# EasyEDA Pro project ProPrj_G4SC5.5开源版.epro, board PCB_G4SC5.5
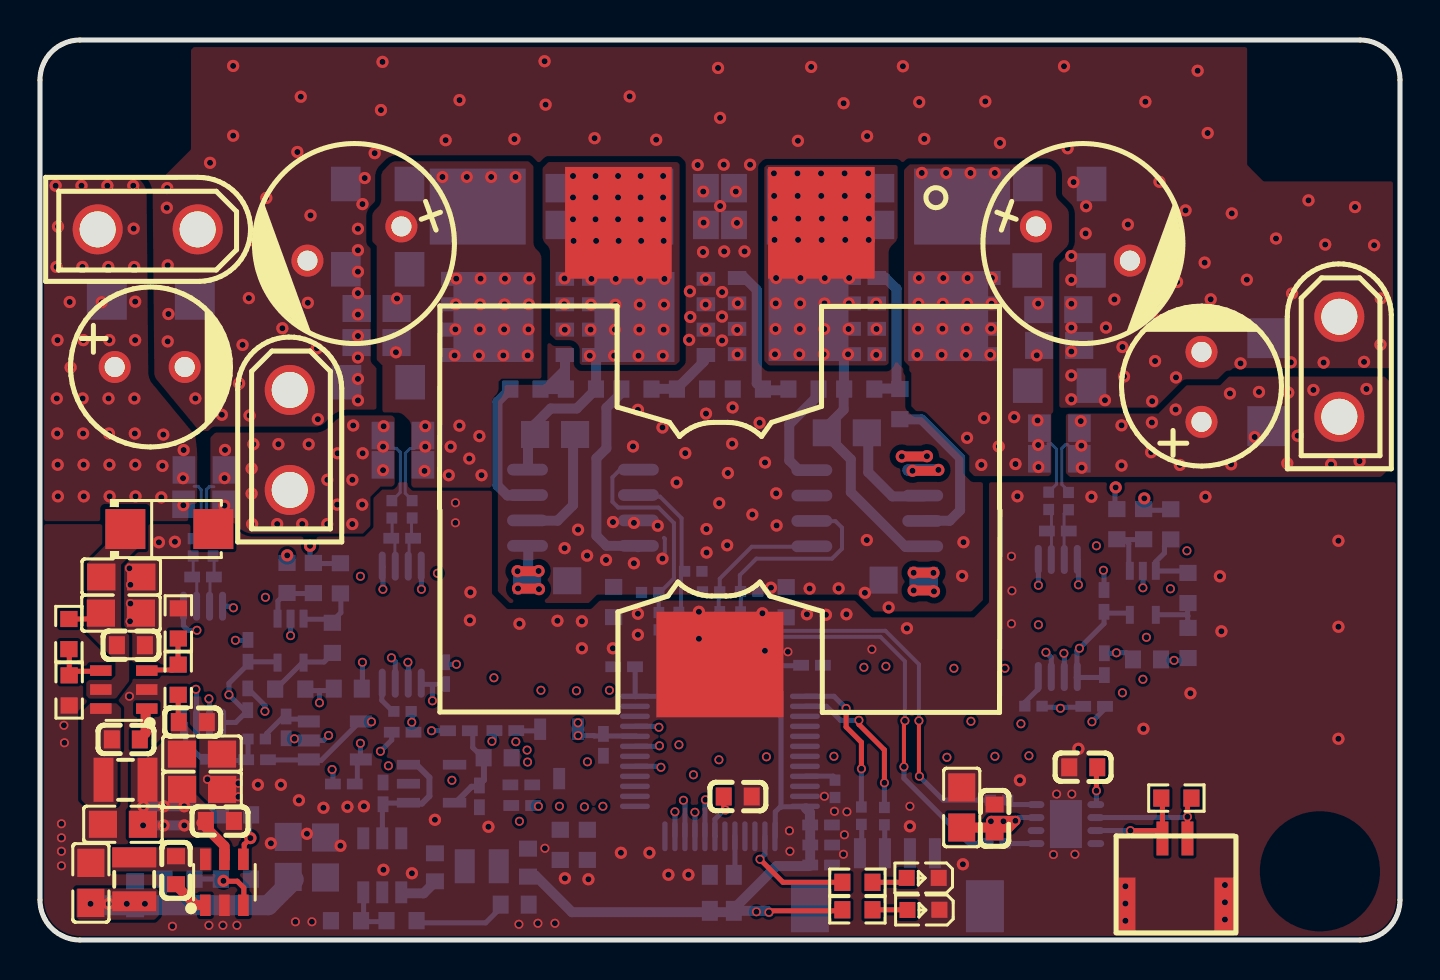
[diagram p4: board, top side]
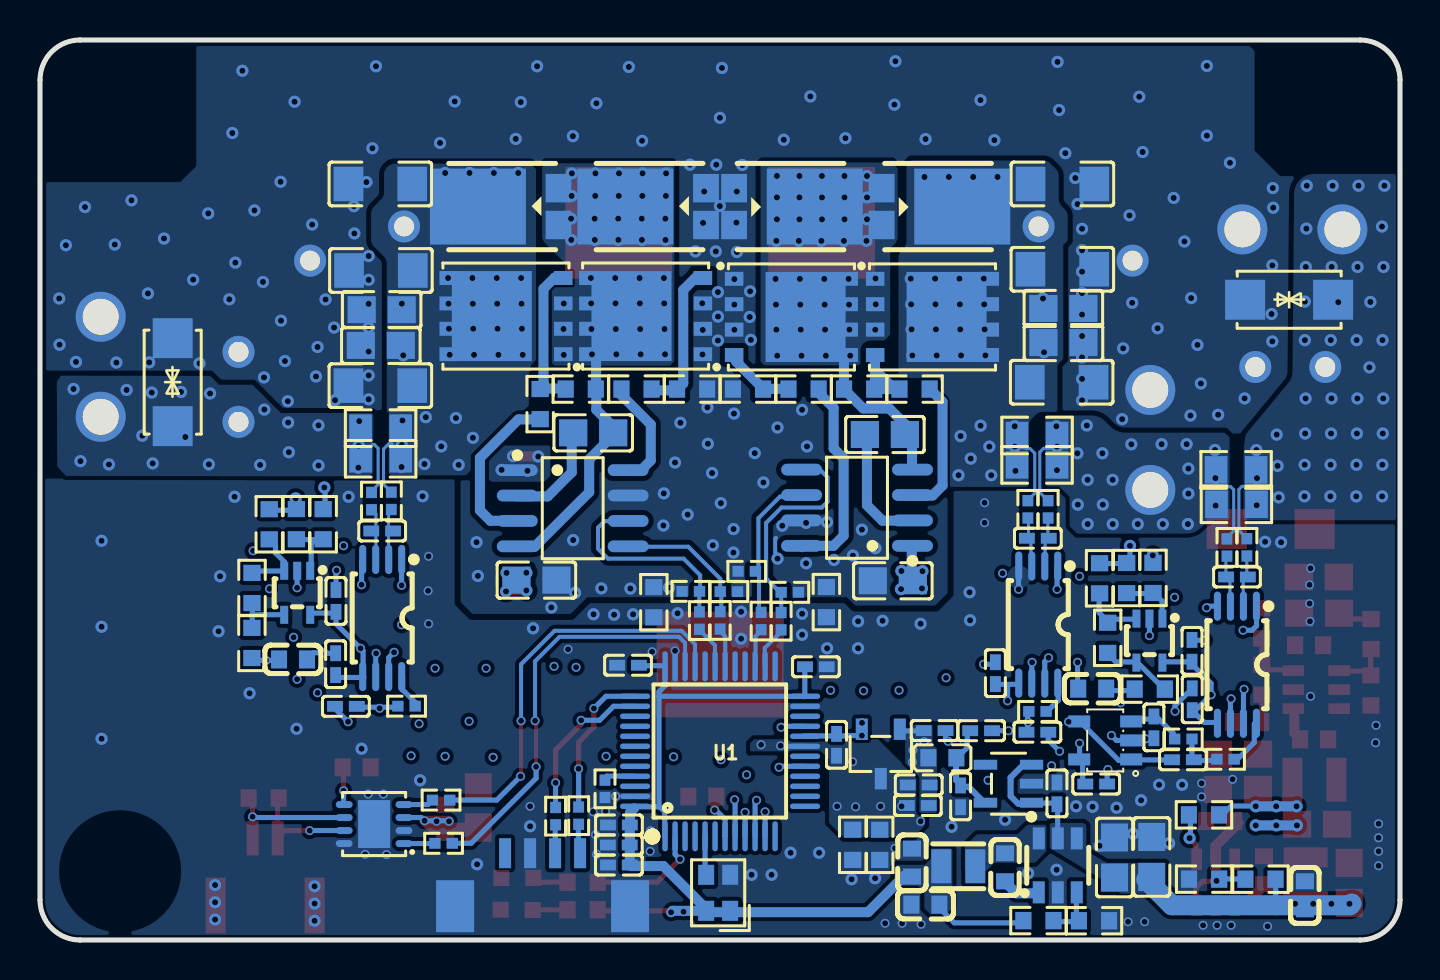
[diagram p5: board, bottom side, seen from below]

Outline 68 x 45 mm; copper layers: Top Layer, Inner1, Inner2, Bottom Layer. Coordinates in mm from the lower left corner of the outline.
Outline path: 0,43 0,2 arc(0.59,0.59) 2,0 66,0 arc(67.41,0.59) 68,2 68,43 arc(67.41,44.41) 66,45 2,45 arc(0.59,44.41) 0,43
Stack: Top Layer 0.035mm / Dielectric1 0.48mm PP er 4.5 / Inner1 0.035mm / Dielectric2 0.48mm FR4 er 4.5 / Inner2 0.035mm / Dielectric3 0.48mm PP er 4.5 / Bottom Layer 0.035mm

## Design rules (mm)
template: 自定义配置
spacing copperThickness1oz (default): track to track 0.102, other pairs 0.11 to 0.3
spacing copperThickness2oz: track to track 0.203, other pairs 0.152 to 0.3
spacing copperThicknessInner0.5oz: track to track 0.089, other pairs 0.152 to 0.3
track width copperThickness1oz (default): min 0.102, default 0.254, max 2.54
track width copperThickness0.5oz: min 0.089, default 0.254, max 2.54
track width copperThickness2oz: min 0.203, default 0.254, max 2.54
differential pair differentialPair (default): width min 0.127, default 0.254, max 2.54; gap min 0.152, default 0.152
via viaSize (default): diameter min 0.3, default 0.61, max 10; hole min 0.2, default 0.305, max 6.3
net VBAT+ uses copperRegion1
pour e76 uses copperRegion1
pour e292 uses copperRegion1
pour e291 uses copperRegion1
pour e290 uses copperRegion1
pour e354 uses copperRegion1
pour e411 uses copperRegion1
pour e534 uses copperRegion1
pour e833 uses copperRegion1
pour e858 uses copperRegion1
pour e913 uses copperRegion1
pour e923 uses copperRegion1
pour e976 uses copperRegion1
pour e1065 uses copperRegion1
pour e1098 uses copperRegion1
pour e1099 uses copperRegion1
pour e1100 uses copperRegion1
pour e1128 uses copperRegion2
pour e2410 uses copperRegion2
pour e2456 uses copperRegion2
pour e2854 uses copperRegion2
pour e2925 uses copperRegion2
pour e2249 uses copperRegion2
pour e11 uses copperRegion1
pour e466 uses copperRegion2
pour e112 uses copperRegion2
pour e215 uses copperRegion1
pour e287 uses copperRegion1
pour e300 uses copperRegion1
pour e317 uses copperRegion2
pour e421 uses copperRegion2
pour e434 uses copperRegion1
pour e942 uses copperRegion2
pour e383 uses copperRegion2
pour e1427 uses copperRegion1
pour e1619 uses copperRegion1
pour e1968 uses copperRegion2
pour e1898 uses copperRegion2
pour e428 uses copperRegion2
pour e3041 uses copperRegion2
pour e3047 uses copperRegion1

## Placement (name value [footprint] x y rotation side)
C1  100nF  [C0402]  20.95 10.46 0 bottom
C2  100nF  [C0402]  23.27 10.47 0 bottom
C3  4.7uF  [C0402]  24.11 6.73 180 bottom
C4  100nF  [C0402]  39.05 5.75 180 bottom
C5  100nF  [C0402]  39.06 4.75 180 bottom
C6  100nF  [C0402]  38.6 13.74 180 bottom
C7  100nF  [C0402]  29.21 13.66 0 bottom
C8  4.7uF  [C0402]  39.06 3.75 180 bottom
C10  10nF  [C0603]  55.35 14.03 180 bottom
C12  10nF  [C0603]  15.39 12.57 0 bottom
C13  100nF  [C0603]  34.89 7.18 180 top
C14  100nF  [C0603]  47.73 6.07 270 top
C15  100nF  [C0603]  52.16 8.64 0 top
C17  100nF  [C0603]  4.29 10.03 180 top
C18  100nF  [C0603]  7.64 10.89 0 top
C19  10uF  [C0805]  8.1 9.3 0 top
C20  10uF  [C0805]  8.1 7.53 0 top
C21  100nF  [C0603]  4.54 14.74 180 top
C22  4.7uF  [C0805]  4.05 16.34 180 top
C23  4.7uF  [C0805]  4.06 18.15 180 top
C24  100nF  [C0603]  6.8 3.49 90 top
C25  100nF  [C0603]  4.76 2.24 90 bottom
C26  10uF  [C0805]  2.54 2.85 90 top
C27  100nF  [C0603]  9 5.95 180 top
C28  4.7uF  [C0805]  4.15 5.79 0 top
C29  100nF  [C0402]  53.22 13.79 90 bottom
C30  10nF  [C0402]  52.71 11.68 180 bottom
C31  4.7uF  [C0402]  17.15 7.33 90 bottom
C32  4.7uF  [C0402]  21.97 7.18 90 bottom
C33  100nF  [C0402]  8.15 18.15 180 bottom
C34  100nF  [C0402]  20.23 13.34 90 bottom
C36  100nF  [C0402]  18.11 20.09 180 bottom
C37  100nF  [C0402]  10.39 12.04 90 bottom
C38  100nF  [C0402]  50.89 20.45 180 bottom
C39  100nF  [C0402]  24.07 7.75 180 bottom
C40  100nF  [C0402]  28.17 9.76 90 bottom
C41  10nF  [C0402]  18.13 10.39 0 bottom
C44  2.2nF  [C0805]  16.83 31.58 0 bottom
C45  2.2nF  [C0805]  16.83 29.87 0 bottom
C46  470uF  [CAP-TH_BD10.0-P5.00-D0.6-FD]  52.15 34.82 340 top
C47  470uF  [CAP-TH_BD10.0-P5.00-D0.6-FD]  15.72 34.82 200 top
C49  2.2nF  [C0805]  50.92 31.52 180 bottom
C50  4.7uF  [C1206]  50.98 27.72 180 bottom
C51  2.2nF  [C0805]  50.96 29.73 180 bottom
C59  100uF  [footprint_08d0]  5.49 28.65 0 top
C111  1uF  [C0805]  25.76 25.27 0 bottom
C112  1uF  [C0805]  40.34 25.36 0 bottom
C113  10uF  [C0805]  43.18 17.99 180 bottom
C114  10uF  [C0805]  25.36 17.96 0 bottom
C115  100uF  [footprint_08d0]  58.08 27.66 90 top
C116  100nF  [C0402]  10.4 14.46 90 bottom
C117  100nF  [C0402]  53.2 16.95 90 bottom
C118  51pF  [C0402]  12.3 10.63 90 bottom
C119  100pF  [C0402]  10.85 9.01 180 bottom
C120  100nF  [C0402]  15.19 7.8 0 bottom
C121  4.7uF  [C1206]  50.95 33.48 180 bottom
C122  4.7uF  [C1206]  16.92 27.89 0 bottom
C123  4.7uF  [C1206]  16.88 37.8 0 bottom
C124  100nF  [C0603]  19.75 3.63 90 bottom
C125  100nF  [C0603]  23.73 1.77 0 bottom
C126  22uF  [C0805]  14.27 4.12 270 bottom
C127  22uF  [C0805]  12.41 4.15 270 bottom
C128  22uF  [C0603]  24.4 3.87 90 bottom
C130  10uF  [C0805]  46.09 6.62 270 top
C131  4.7uF  [C1206]  50.98 37.8 180 bottom
C132  4.7uF  [C1206]  16.88 33.54 0 bottom
CAN1  GH1.25-2P-立式贴片  [footprint_47b1]  56.75 3.4 180 top
CN1  XT30UPB-M  [footprint_f264]  64.97 28.66 270 top
CN4  XT30UPB-M  [footprint_f264]  5.38 35.53 180 top
CN5  XT30UPB-M  [footprint_5e48]  12.49 25 270 top
D1  SS210  [SMA_L4.3-W2.6-LS5.2-RD]  6.47 20.55 0 top
D2  SMAJ36CA-M3/5A  [footprint_4a09]  5.54 32.01 0 bottom
D3  SMAJ36CA-M3/5A  [footprint_d8e9]  61.37 27.89 270 bottom
D12  SD10U50SL  [TO-277_3P-L5.4-W4.0-LS6.5-BR]  23.9 36.67 0 bottom
D13  SD10U50SL  [TO-277_3P-L5.4-W4.0-LS6.5-BR]  31.28 36.67 0 bottom
D14  SD10U50SL  [TO-277_3P-L5.4-W4.0-LS6.5-BR]  36.72 36.67 180 bottom
D15  SD10U50SL  [TO-277_3P-L5.4-W4.0-LS6.5-BR]  44.09 36.67 180 bottom
J1  GH1.25_4P_OK  [footprint_bfbb]  47.05 4.97 180 bottom
L1  GZ1608D601TF  [L0603]  22.88 9.11 0 bottom
L3  PQ2918大功率电感  [footprint_2825]  34 24.82 180 top
L4  22uH  [IND-SMD_L2.5-W2.0_MHCHL2520]  4.71 3.03 270 top
L5  4.7uH  [IND-SMD_L2.0-W1.6-B]  22.09 3.69 0 bottom
LED1  FC-DA1608HRK-620D  [footprint_1976]  44.17 1.51 180 top
LED2  FC-D1608UGK-520D10  [footprint_0091]  44.14 3.11 180 top
Q1  BSC028N06NS  [PG-TDSON-8_L5.0-W6.0-P1.27-LS6.2-BL-EP]  23.38 31.15 270 bottom
Q3  BSC028N06NS  [PG-TDSON-8_L5.0-W6.0-P1.27-LS6.2-BL-EP]  44.7 31.2 90 bottom
Q4  BSC028N06NS  [PG-TDSON-8_L5.0-W6.0-P1.27-LS6.2-BL-EP]  30.43 31.15 270 bottom
Q5  BSC028N06NS  [PG-TDSON-8_L5.0-W6.0-P1.27-LS6.2-BL-EP]  37.72 31.2 90 bottom
R1  33Ω  [R0402]  42.22 6.19 90 bottom
R2  33Ω  [R0402]  41.07 6.22 90 bottom
R3  4.7kΩ  [R0603]  40.87 2.89 0 top
R4  4.7kΩ  [R0603]  40.87 1.51 0 top
R9  330Ω  [R0603]  57.4 14.85 270 bottom
R10  4.7kΩ  [R0402]  39.75 7.56 270 bottom
R14  330Ω  [R0603]  12.51 12.54 0 bottom
R15  120Ω  [R0603]  56.82 7.1 0 top
R17  10kΩ  [R0603]  1.46 12.48 90 top
R18  330Ω  [R0402]  49.67 11.69 0 bottom
R21  330Ω  [R0402]  18.12 11.43 0 bottom
R30  0Ω  [footprint_0952]  26.01 4.76 270 bottom
R31  0Ω  [footprint_0952]  28.68 16.9 270 bottom
R32  10Ω  [R0402]  7.66 19.63 270 bottom
R33  10Ω  [R0402]  8.65 19.63 270 bottom
R34  10Ω  [R0402]  50.43 21.96 270 bottom
R35  10Ω  [R0402]  51.43 21.95 270 bottom
R36  10Ω  [R0402]  17.59 21.53 270 bottom
R38  10Ω  [R0402]  18.61 21.53 270 bottom
R39  2mΩ  [footprint_0379]  8.2 23.5 0 bottom
R40  2mΩ  [footprint_0379]  8.18 21.79 0 bottom
R41  2mΩ  [footprint_0379]  18.15 25.22 0 bottom
R42  2mΩ  [footprint_0379]  18.15 23.76 0 bottom
R43  2mΩ  [footprint_0379]  50.97 24.06 0 bottom
R44  2mΩ  [footprint_0379]  50.97 25.59 0 bottom
R45  0Ω  [footprint_0952]  37.31 16.89 270 bottom
R46  0Ω  [footprint_0952]  27.37 4.76 270 bottom
R47  100kΩ  [R0603]  1.45 15.3 90 top
R48  1Ω  [R0603]  24.27 27.55 0 bottom
R49  1Ω  [R0603]  29.82 27.55 0 bottom
R50  10kΩ  [R0603]  40.96 27.55 0 bottom
R51  10kΩ  [R0603]  35.39 27.55 0 bottom
R52  10kΩ  [R0603]  32.6 27.55 180 bottom
R53  10kΩ  [R0603]  27.04 27.55 180 bottom
R54  1Ω  [R0603]  42.99 26.8 270 bottom
R55  1Ω  [R0603]  38.17 27.55 0 bottom
R56  4.7kΩ  [R0402]  32.66 18.43 180 bottom
R57  4.7kΩ  [R0402]  30.51 17.39 0 bottom
R58  33Ω  [R0402]  30.95 15.94 270 bottom
R59  33Ω  [R0402]  31.94 15.95 270 bottom
R60  56kΩ  [R0603]  6.98 3.04 180 bottom
R61  10.7kΩ  [R0603]  9.79 3.04 180 bottom
R64  10kΩ  [R0603]  6.92 15.83 270 top
R65  1MΩ  [R0603]  9.8 6.26 180 bottom
R66  33Ω  [R0402]  35.03 15.97 270 bottom
R67  33Ω  [R0402]  33.99 15.98 270 bottom
R68  4.7kΩ  [R0402]  35.46 17.43 180 bottom
R69  4.7kΩ  [R0402]  33.56 17.42 0 bottom
R70  4.7kΩ  [R0603]  13.67 18.1 270 bottom
R71  4.7kΩ  [R0603]  55.18 20.79 270 bottom
R72  4.7kΩ  [R0603]  57.4 17.6 270 bottom
R73  4.7kΩ  [R0603]  14.62 15.11 270 bottom
R74  51kΩ  [R0603]  56.54 20.79 270 bottom
R75  51kΩ  [R0603]  53.84 20.79 270 bottom
R76  51kΩ  [R0603]  15.02 18.09 270 bottom
R77  51kΩ  [R0603]  12.35 18.1 270 bottom
R78  47kΩ  [R0402]  8.72 9.04 0 bottom
R79  47kΩ  [R0402]  10.83 10.05 0 bottom
R80  2.2kΩ  [R0603]  15.3 0.96 0 bottom
R81  10kΩ  [R0603]  18.08 0.97 0 bottom
R82  33Ω  [R0402]  47.82 4.84 0 bottom
R83  33Ω  [R0402]  47.95 7 0 bottom
U1  STM32G474CBT6  [LQFP-48_L7.0-W7.0-P0.50-LS9.0-BL]  34 9.44 180 bottom
U3  LGS5116B  [SOT-23-6_L2.9-W1.6-P0.95-LS2.8-BR]  17.11 3.73 270 bottom
U5  SIT1044QTK/3  [TDFN-8_L3.0-W3.0-P0.65-BL-EP]  51.3 5.8 90 bottom
U6  LGS5148  [footprint_d9ac]  4.19 12.52 90 top
U7  REF3030AIDBZR  [footprint_6933]  25.96 9.3 90 bottom
U11  22uH  [IND-SMD_L2.5-W2.0_MHCHL2520]  4.28 8.01 0 top
U12  HE9073A33M5R  [footprint_751e]  19.58 7.82 90 bottom
U15  INA240A2QPWRQ1  [footprint_93e1]  8.15 13.76 0 bottom
U16  INA240A2QPWRQ1  [footprint_93e1]  50.89 16.1 0 bottom
U17  INA240A2QPWRQ1  [footprint_93e1]  18.09 15.77 0 bottom
U19  SLM27211CA-DG  [SOIC-8_L4.9-W3.9-P1.27-LS6.0-BL]  41.36 21.59 270 bottom
U20  SLM27211CA-DG  [SOIC-8_L4.9-W3.9-P1.27-LS6.0-BL]  27.15 21.61 90 bottom
U21  LGS5148  [footprint_d9ac]  9.22 2.89 0 top
U23  113kΩ  [R0603]  6.91 13.02 270 top
U24  LTC8333XC5/R6  [SC-70-5_L2.1-W1.3-P0.65-LS2.1-BR]  55.14 17.36 90 bottom
U25  LTC8333XC5/R6  [SC-70-5_L2.1-W1.3-P0.65-LS2.1-BR]  12.53 14.97 90 bottom
U26  LTC8631XT5/R6  [SOT-23-5_L3.0-W1.7-P0.95-LS2.8-BR]  14.74 9.98 180 bottom
U27  8MHz  [OSC-SMD_4P-L2.0-W1.6-BL]  34.09 2.36 90 bottom

## Footprints (pads in the part's own frame, mm; a bottom-side part is the same pattern mirrored in y, then rotated)
C0402
  rect 0.79x0.54 smd: 1(-0.545,0) 2(0.545,0)
C0603
  rect 0.8x0.9 smd: 1(-0.7,0) 2(0.7,0)
C0805
  rect 1.41x1.35 smd: 1(-1,0) 2(1,0)
C1206
  rect 1.485x1.728 smd: 1(-1.593,0) 2(1.593,0)
CAP-TH_BD10.0-P5.00-D0.6-FD
  round 1.6 hole 1: 1(-2.5,0) 2(2.5,0)
footprint_4a09
  rect 2x2 smd: 1(-2.2,0) 2(2.2,0)
footprint_5e48
  round 2.5 hole 1.8: 1(-2.5,0.001) 2(2.5,0.001)
footprint_08d0
  round 1.6 hole 1x1.005: 1(-1.75,0) 2(1.75,0)
footprint_47b1
  rect 0.6x1.7 smd: 1(-0.625,-1.675) 2(0.625,-1.675)
  rect 1x2.8 smd: 3(-2.475,1.675) 4(2.475,1.675)
footprint_0091
  rect 0.8x0.8 smd: 1(-0.799,0) 2(0.799,0)
footprint_93e1
  oval 0.353x1.454 smd: 1(-0.975,-2.927) 2(-0.325,-2.927) 3(0.325,-2.927) 4(0.975,-2.927) 5(0.975,2.927) 6(0.325,2.927) 7(-0.325,2.927) 8(-0.975,2.927)
footprint_0379
  rect 1.133x1.377 smd: 1(-1,0) 2(1,0)
footprint_751e
  rect 0.49x1.157 smd: 1(-0.95,-1.154) 2(0,-1.154) 3(0.95,-1.154)
  rect 0.49x1.175 smd: 4(0.95,1.153) 5(-0.95,1.153)
footprint_0952
  rect 0.806x0.864 smd: 1(-0.753,0) 2(0.753,0)
footprint_1976
  rect 0.8x0.8 smd: 1(-0.799,-0.004) 2(0.799,0.004)
footprint_2825
  rect 5.33x5.59 smd: 1(-5.075,-11.042) 2(5.075,-11.042)
  rect 6.35x5.28 smd: 3(0,11.042)
footprint_6933
  rect 1.07x0.6 smd: 1(1.235,-0.95) 2(1.235,0.95) 3(-1.235,0)
footprint_bfbb
  rect 0.6x1.5 smd: 1(2.307,-0.635) 2(3.557,-0.635) 3(4.807,-0.635) 4(6.056,-0.635)
  rect 1.9x2.6 smd: 9(8.556,-3.285) 10(-0.193,-3.285)
footprint_d8e9
  rect 2x2 smd: 1(-2.2,0) 2(2.2,0)
footprint_d9ac
  rect 0.532x1.072 smd: 1(-0.95,-1.149) 2(0,-1.149) 3(0.95,-1.149) 4(0.95,1.149) 5(0,1.149) 6(-0.95,1.149)
footprint_f264
  round 2.5 hole 1.8: 1(-2.5,0) 2(2.5,0)
IND-SMD_L2.0-W1.6-B
  rect 1x1.7 smd: 1(-0.85,0) 2(0.85,0)
IND-SMD_L2.5-W2.0_MHCHL2520
  rect 1x2.2 smd: 1(-1.1,0) 2(1.1,0)
L0603
  rect 0.8x0.864 smd: 1(-0.7,0) 2(0.7,0)
LQFP-48_L7.0-W7.0-P0.50-LS9.0-BL
  oval 0.27x1.5 smd: 1(-2.75,-4.25) 2(-2.25,-4.25) 3(-1.75,-4.25) 4(-1.25,-4.25) 5(-0.75,-4.25) 6(-0.25,-4.25) 7(0.25,-4.25) 8(0.75,-4.25) 9(1.25,-4.25) 10(1.75,-4.25) 11(2.25,-4.25) 12(2.75,-4.25) 25(2.75,4.25) 26(2.25,4.25) 27(1.75,4.25) 28(1.25,4.25) 29(0.75,4.25) 30(0.25,4.25) 31(-0.25,4.25) 32(-0.75,4.25) 33(-1.25,4.25) 34(-1.75,4.25) 35(-2.25,4.25) 36(-2.75,4.25)
  oval 1.5x0.27 smd: 13(4.25,-2.75) 14(4.25,-2.25) 15(4.25,-1.75) 16(4.25,-1.25) 17(4.25,-0.75) 18(4.25,-0.25) 19(4.25,0.25) 20(4.25,0.75) 21(4.25,1.25) 22(4.25,1.75) 23(4.25,2.25) 24(4.25,2.75) 37(-4.25,2.75) 38(-4.25,2.25) 39(-4.25,1.75) 40(-4.25,1.25) 41(-4.25,0.75) 42(-4.25,0.25) 43(-4.25,-0.25) 44(-4.25,-0.75) 45(-4.25,-1.25) 46(-4.25,-1.75) 47(-4.25,-2.25) 48(-4.25,-2.75)
OSC-SMD_4P-L2.0-W1.6-BL
  rect 1x0.8 smd: 1(-0.9,-0.6) 2(0.9,-0.6) 3(0.9,0.6) 4(-0.9,0.6)
PG-TDSON-8_L5.0-W6.0-P1.27-LS6.2-BL-EP
  rect 0.7x0.925 smd: 1(-1.905,-2.865) 2(-0.635,-2.865) 3(0.635,-2.865) 4(1.905,-2.865) 5(1.905,2.865) 6(0.635,2.865) 7(-0.635,2.865) 8(-1.905,2.865)
  rect 4.5x4 smd: 9(0.001,0.705)
R0402
  rect 0.566x0.54 smd: 1(-0.433,0) 2(0.433,0)
R0603
  rect 0.806x0.864 smd: 1(-0.753,0) 2(0.753,0)
SC-70-5_L2.1-W1.3-P0.65-LS2.1-BR
  rect 0.9x0.4 smd: 1(1.1,-0.65) 2(1.1,0) 3(1.1,0.65) 4(-1.1,0.65) 5(-1.1,-0.65)
SMA_L4.3-W2.6-LS5.2-RD
  rect 2x2 smd: 1(-2.2,0) 2(2.2,0)
SOIC-8_L4.9-W3.9-P1.27-LS6.0-BL
  oval 0.588x2.045 smd: 1(-1.905,-2.772) 2(-0.635,-2.772) 3(0.635,-2.772) 4(1.905,-2.772) 5(1.905,2.772) 6(0.635,2.772) 7(-0.635,2.772) 8(-1.905,2.772)
SOT-23-5_L3.0-W1.7-P0.95-LS2.8-BR
  rect 1.1x0.6 smd: 1(1.3,-0.95) 2(1.3,0) 3(1.3,0.95) 4(-1.3,0.95) 5(-1.3,-0.95)
SOT-23-6_L2.9-W1.6-P0.95-LS2.8-BR
  rect 1.1x0.6 smd: 1(1.35,-0.95) 2(1.35,0) 3(1.35,0.95) 4(-1.35,0.95) 5(-1.35,0) 6(-1.35,-0.95)
TDFN-8_L3.0-W3.0-P0.65-BL-EP
  oval 0.35x0.84 smd: 1(-0.975,-1.495) 2(-0.325,-1.495) 3(0.325,-1.495) 4(0.975,-1.495) 5(0.975,1.495) 6(0.325,1.495) 7(-0.325,1.495) 8(-0.975,1.495)
  rect 2.4x1.6 smd: 9(0,0)
TO-277_3P-L5.4-W4.0-LS6.5-BR
  rect 1.29x1.423 smd: 1(2.017,-0.92) 3(2.017,0.92)
  rect 4.8x3.8 smd: 2(-2.017,0)

## Nets
As in the schematic, except:
GND: C4.1 C5.1 C6.1 C7.1 C8.1 C13.1 C14.1 C15.1 C18.2 C19.2 C20.2 C21.1 C22.1 C23.1 C25.2 C26.2 C27.1 C28.1 C31.2 C32.1 C125.2 C126.1 C127.1 C128.2 C130.1 CAN1.3 CAN1.4 J1.2 J1.9 J1.10 L3.3 LED1.1 LED2.1 R10.2 R17.1 R30.2 R31.2 R45.2 R46.2 R61.1 R64.1 R80.1 U1.23 U1.35 U1.47 U3.2 U5.2 U5.8 U5.9 U6.2 U12.2 U21.2 U27.2

Pads without a net: J1 1; U1 3 4 6 12 13 14 15 16 18 22 25 28 29 32 39 40 41 42 43 44 46; U12 4

## Via types
v1: diameter 0.45, hole 0.3, Top Layer to Bottom Layer, 146 vias
v2: diameter 0.61, hole 0.305, Top Layer to Bottom Layer, 466 vias

## Routing (per net, layer and track width the routed paths; a pad name or vN(x,y) marks a point on that pad's centre or on a via; arc(x,y) is an arc through that point)
3V3: length 4.2
  Bottom Layer w0.254: 22.14,9.12 21.64,9.62 21.64,10.39
  Bottom Layer w0.3: 22.2,9.05 22.2,8 21.96,7.76 ; 21.84,7.66 21.58,7.66 20.8,6.89
3VR: length 54.5
  Inner1 w0.254: v1(18.4,13.89) 18.4,12.97 18.39,12.97 ; v1(8.45,12.06) 8.45,12.71 8.7,12.97 18.39,12.97 ; 18.39,12.97 21.47,12.97 24.02,10.41 26.72,10.41 v1(26.91,10.22) 26.91,10.85 v1(26.9,10.86) 27.2,11.16 37.32,11.16 38.8,12.64 50.39,12.64 51.17,13.42 51.17,14.31 v1(51.2,14.34)
  Bottom Layer w0.254: U17.6 18.41,13.87 v1(18.4,13.89) ; v1(51.2,14.34) 51.22,14.32 U16.6 ; v1(8.45,12.06) 8.48,12.03 U15.6 ; 29.81,10.2 27.72,10.2 27.7,10.22 v1(26.91,10.22)
5V: length 78.1
  Top Layer w0.5: v1(47.55,5.94) 47.57,5.96 v1(48.77,5.96) 48.44,5.62 C130.2
  Inner1 w0.5: v1(48.77,5.96) 48.75,5.94 v1(48.17,5.94) v1(47.55,5.94) 47.65,5.83 47.65,2.64 47.3,2.29 34.47,2.29 34,1.81 v2(5.25,1.81) v2(4.34,1.81) v2(3.43,1.81) v2(2.53,1.81)
  Inner2 w0.5: v2(2.53,1.81) v2(3.43,1.81) v2(4.34,1.81) v2(5.25,1.81) ; v1(47.55,5.94) v1(48.17,5.94) 48.75,5.94 v1(48.77,5.96)
  Bottom Layer w0.254: U5.3 48.93,6.12 v1(48.77,5.96) 47.57,5.96 v1(47.55,5.94)
  Bottom Layer w0.256: 17.18,6.71 17.12,6.65 17.12,5.08 ; 18.26,6.84 17.35,6.84 17.15,6.65 ; 6.22,1.74 6.22,2.84
  Bottom Layer w0.3: 18.88,8.72 19.47,8.12 19.47,7.19 19.09,6.82 18.41,6.82
  Bottom Layer w1: 2.42,1.82 2.51,1.74 11.41,1.74 12.69,3.02
10V: length 84.7
  Top Layer w0.254: 6.99,12.25 6.91,12.16 6.91,10.89
  Top Layer w0.5: v2(44.35,24.19) 44.33,24.18 v2(43.09,24.18) ; v2(24.95,17.54) 24.91,17.58 v2(23.9,17.58) ; v2(43.68,17.48) 44.65,17.48 v2(44.7,17.43) ; v2(23.88,18.44) 24.92,18.44 v2(24.93,18.45) ; v2(44.92,23.51) 44.88,23.46 v2(43.63,23.46) ; v2(44.67,18.36) 44.67,18.36 v2(43.68,18.36) ; 9.23,4.04 9.23,4.7 8.07,5.86
  Inner1 w0.5: v2(43.09,24.18) 44.33,24.18 v2(44.35,24.19) ; v2(43.63,23.46) 44.88,23.46 v2(44.92,23.51)
  Inner1 w1: 44.2,17.88 43.8,17.48 v2(43.68,17.48) ; 44.2,17.88 v2(44.67,18.36) ; 44.2,17.88 44.42,17.66 ; 5.6,15.59 5.57,15.61 5.57,17.59 6.12,18.14 14.15,18.14 15.72,19.71 20.97,19.71 22.7,17.99 24.67,17.99 ; 5.6,6.19 5.6,15.54
  Inner2 w0.5: v2(7.21,6.69) v2(6.19,6.69) v2(5.17,6.69) ; v2(7.21,5.73) v2(6.19,5.73) v2(5.16,5.73)
  Inner2 w1: 44.16,23.66 44.13,23.62 44.13,18.67 ; 44.13,18.67 35.67,18.67 34.61,17.62 24.53,17.62 24.22,17.93 ; 44.13,18.67 44.13,18.67 44.17,18.64 ; 44.13,18.67 44.13,17.94
  Bottom Layer w0.254: 8.94,6.2 8.44,6.7 7.27,6.7
  Bottom Layer w0.5: v2(5.17,6.69) v2(6.19,6.69) v2(7.21,6.69) ; v2(5.16,5.73) v2(6.19,5.73) v2(7.21,5.73) ; 24.41,17.96 24.41,19.55 24.35,19.61
24V: length 1.4
  Top Layer w0.254: 2.83,16.02 2.8,16.05 1.47,16.05
A3V3: length 70.1
  Inner1 w0.254: v1(51.97,14.59) 51.97,12.94 51.14,12.11 39.05,12.11 37.57,10.64 v1(30.95,10.64) 28.1,10.64 26.96,9.5 v1(24.35,9.5) ; v1(19.62,11.96) 19.65,11.99 19.65,12.49 ; v1(9.45,12.26) 9.7,12.51 21.19,12.51 v1(23.79,9.91) 24.38,9.33 v1(24.38,8.9) ; v1(16.02,9.84) 16.02,12.44 16,12.46
  Bottom Layer w0.254: C37.1 10.22,11.49 v1(9.45,12.26) 9.45,12.83 10.4,13.79 C116.1 ; 53.29,16.34 54.49,16.34 54.54,16.29 ; 11.86,13.93 11.84,13.91 10.43,13.91 ; U16.5 51.85,13.19 51.85,14.46 v1(51.97,14.59) 53.2,15.82 C117.1 ; 15.78,7.75 15.87,7.84 15.87,8.96 16.02,9.11 v1(16.02,9.84) ; v1(19.62,11.96) 19.62,12.74 ; 53.27,13.22 53.18,13.13 51.81,13.13 ; v1(30.95,10.64) 30.9,10.69 U1.21 ; 23.85,10.46 25.1,10.46 25.12,10.48 ; 19.05,12.78 20.15,12.78 20.17,12.77 ; 10.39,11.47 9.79,10.88 9.13,10.88
AGND: length 27.9
  Bottom Layer w0.254: v1(52.6,10.91) 53.25,11.57 53.25,11.68 ; C12.2 16.12,12.6 v1(16.12,13.89) ; U17.7 17.76,13.92 v1(17.57,14.11) ; 14.65,7.8 14.65,8.48 v1(14.61,8.52) ; v1(17.02,9.44) 17.59,10 C41.1 ; v1(20.82,13.79) 20.33,13.79 C34.2 ; v1(11.25,11.44) 11.25,11.72 C37.2 ; v1(55.15,17.61) 55.15,18.45 U24.2 ; U17.4 19.07,18.69 v1(19.07,17.54) ; v1(53.17,18.49) 53.2,18.46 C117.2 ; v1(14.43,10.23) 14.18,9.98 U26.2 13.33,10.09 C118.1 ; v1(19.58,10.46) C1.1 ; C116.2 10.38,14.99 v1(9.77,14.99) ; v1(50.3,14.39) 50.57,14.12 U16.7 ; U15.4 9.59,16.69 v1(9.67,16.61) ; C29.2 53.8,14.34 v1(53.82,14.36) 54.32,14.36 54.65,14.03 ; U16.4 51.92,18.97 v1(51.92,17.76) ; v1(49.92,17.74) 49.92,19.02 U16.1 ; U15.1 7.17,16.68 7.17,15.71 7.4,15.49 v1(7.85,15.49) ; v1(22.6,9.94) 22.72,10.06 C2.1 ; U1.19 30.95,9.69 v1(30.97,9.71) ; U17.1 17.15,18.66 v1(17.15,17.54) ; v1(12.53,15.22) U25.2 ; U15.7 7.83,12.5 v1(7.8,12.54)
  vias: v1(11.27,17.14) v1(12.72,10.06) v1(16.02,18.19) v1(17.42,8.71) v1(19.87,18.34) v1(20.6,7.99) v1(22.7,13.11) v1(23.97,5.94) v1(24.92,6.69) v1(25.05,12.49) v1(25.97,6.69) v1(26.82,12.46) v1(27.22,6.66) v1(27.37,8.91) v1(28.15,6.69) v1(28.47,12.49) v1(31.95,9.76) v1(32.67,8.26) v1(33.95,9.01) v1(36.32,9.16) v1(39.7,9.19) v1(41.2,13.64) v1(42.3,13.69) v1(45.35,9.14) v1(45.7,13.59) v1(46.55,10.94) v1(47.75,9.19) v1(48.25,13.59) v1(49.05,10.81) v1(49.45,9.21) v1(49.92,15.76) v1(52.82,19.71) v1(54.12,12.36) v1(55.15,13.04) v1(55.32,15.14) v1(56.52,17.56) v1(57.35,19.46)
D3V3: length 72.2
  Top Layer w0.254: v1(36.45,1.39) 36.52,1.46 40.07,1.46 R4.1 ; v1(52.82,7.46) 52.82,8.59 C15.2
  Inner1 w0.5: v1(35.82,1.41) 36.42,1.41 v1(36.45,1.39) 50,1.39 52.82,4.21 v1(52.82,7.46)
  Bottom Layer w0.254: 37.05,6.64 37.05,6.66 ; 37.05,6.66 38.19,6.66 ; 37.05,6.66 37.05,12.13 ; 37.05,6.66 37.02,6.66 36.77,6.41 36.77,5.17 ; U5.5 52.82,6.8 v1(52.82,7.46) ; 38.07,13.71 36.82,13.71 36.81,13.72 ; 29.78,13.62 29.76,13.59 29.76,12.17 ; 37.06,12.18 37.06,12.18 29.81,12.18 29.79,12.17 ; 37.05,12.24 37.05,12.41 36.75,12.71 36.75,13.72 36.77,13.74
  Bottom Layer w0.256: 18.63,0.86 22.29,0.86 23.02,1.59
  Bottom Layer w0.5: 38.51,3.79 38.51,5.74 38.5,5.76 ; 38.5,5.66 38.5,5.76 ; 38.5,5.76 38.5,6.38 38.29,6.59 ; 38.5,5.76 38.49,5.77 ; 34.6,1.39 26.6,1.39 24.77,3.22 24.25,3.22 ; U27.4 36.37,1.46 v1(36.45,1.39) ; 34.8,1.49 34.8,1.67 36.83,3.7 38.47,3.7
GND:
  vias: v1(1.07,5.81) v1(1.07,5.11) v1(1.07,4.44) v1(1.07,3.71) v1(1.2,10.74) v1(1.22,9.86) v1(4.47,18.59) v1(4.52,17.76) v1(4.52,16.82) v1(4.5,15.93) v1(4.47,12.19) v1(6.62,0.69) v1(8.37,8.04) v1(8.45,0.74) v1(9.15,0.74) v1(9.85,0.74) v1(9.92,7.84) v1(9.92,7.16) v1(12.77,0.91) v1(13.6,0.91) v1(20.77,21.86) v1(20.77,20.86) v1(23.95,0.79) v1(24.9,0.84) v1(25.25,4.59) v1(25.75,0.84) v1(36.25,14.46) v1(37.4,14.41) v1(37.47,5.46) v1(37.5,4.44) v1(39.22,7.19) v1(39.72,6.44) v1(40.22,5.26) v1(40.17,4.29) v1(40.35,6.41) v1(41.6,14.54) v1(43.5,6.69) v1(48.57,19.19) v1(48.6,17.46) v1(48.57,15.81) v1(50.67,4.27) v1(50.83,7.3) v1(51.59,7.3) v1(51.75,4.29) v2(5.95,19.89) v2(6.75,19.91) v2(10.9,7.76) v2(11.55,4.84) v2(12.05,7.76) v2(12.95,6.99) v2(13.35,5.31) v2(14.17,6.61) v2(15.02,4.71) v2(15.37,6.66) v2(16.2,6.69) v2(17.17,3.51) v2(18.6,3.34) v2(19.75,6.01) v2(21.52,17.39) v2(21.5,15.99) v2(22.42,5.66) v2(23.97,15.81) v2(25.87,15.96) v2(26.25,3.09) v2(27.1,15.94) v2(27.1,14.59) v2(27.42,3.04) v2(28.65,14.59) v2(29.05,4.36) v2(29.9,16.31) v2(29.9,15.26) v2(30.47,4.36) v2(31.42,3.26) v2(32.42,3.26) v2(32.95,16.41) v2(32.95,15.06) v2(36.12,16.34) v2(38.35,16.29) v2(39.3,16.26) v2(40.32,16.29) v2(43.35,15.59) v2(43.5,5.69) v2(46.15,3.79) v2(48.87,22.19) v2(49,7.99) v2(51.92,9.56) v2(52.57,22.16) v2(54.27,2.69) v2(54.27,1.82) v2(54.27,0.96) v2(55.17,10.56) v2(57.52,12.34) v2(58.27,22.16) v2(59,18.19) v2(59.07,15.44) v2(59.25,2.75) v2(59.25,1.89) v2(59.25,1.02) v2(64.92,19.96) v2(64.92,15.66) v2(64.92,10.06)
PGND: length 38.7
  Inner2 w0.12: 6.98,28.62 6.96,28.61 5.56,28.61 5.46,28.51 5.44,28.49 5.44,28.31 5.69,27.97 ; 5.69,27.97 5.7,27.96 ; 5.69,27.97 7.71,25.52 7.92,25.18 7.92,20.33 8.54,19.71 v2(13.5,19.71) ; 5.69,27.97 5.69,27.98 ; 55.23,22.16 55.79,22.71 66.56,22.71 67.3,23.46 67.3,28.51 67.22,28.6
  Bottom Layer w0.2: 31.2,20.11 31.24,20.06 31.24,19.38
  Bottom Layer w0.254: 56.62,21.5 56.61,21.49 55.21,21.49 ; 13.68,18.82 14.96,18.82 15,18.86 ; 13.59,18.84 13.5,18.93 v2(13.5,19.71)
  vias: v2(6.34,36.61) v2(6.36,37.6) v2(6.38,33.73) v2(6.42,31.3) v2(6.38,29.93) v2(7.77,27.08) v2(8.5,38.86) v2(9.09,26.26) v2(9.66,43.7) v2(9.66,40.22) v2(9.96,27.83) v2(10.13,29.75) v2(10.44,32.1) v2(10.48,26.22) v2(10.78,34.93) v2(11.32,37.1) v2(12.12,30.59) v2(12.87,39.4) v2(13.04,42.16) v2(13.39,31.86) v2(13.53,36.23) v2(13.84,29.58) v2(13.89,26.04) v2(15.9,35.56) v2(15.9,34.49) v2(15.9,33.42) v2(15.9,32.34) v2(15.9,31.27) v2(15.9,30.2) v2(15.9,29.13) v2(15.9,28.05) v2(15.9,26.98) v2(16.12,36.8) v2(16.24,38.1) v2(16.73,39.34) v2(17.12,43.9) v2(17.05,41.5) v2(20.28,39.99) v2(20.98,42) v2(23.72,40.05) v2(25.23,43.94) v2(25.28,41.77) v2(26.23,19.59) v2(26.9,20.52) v2(27.35,19.22) v2(27.73,40.09) v2(28.3,19) v2(28.65,20.9) v2(29.48,42.18) v2(29.65,24.68) v2(29.7,20.86) v2(29.7,18.84) v2(29.9,26.51) v2(30.81,40.01) v2(30.89,20.71) v2(31.12,25.63) v2(31.12,19.07) v2(31.83,22.88) v2(32.26,24.34) v2(32.5,32.43) v2(32.51,31.15) v2(32.46,30.01) v2(32.88,38.75) v2(33.16,37.42) v2(33.18,35.87) v2(33.15,34.4) v2(33.28,33.04) v2(33.28,31.77) v2(33.28,30.51) v2(33.3,26.32) v2(33.32,20.55) v2(33.33,19.37) v2(33.9,43.6) v2(34,41.11) v2(34.01,36.7) v2(33.96,21.84) v2(34.11,32.4) v2(34.1,31.17) v2(34.1,29.97) v2(34.19,38.76) v2(34.21,34.43) v2(34.4,23.35) v2(34.36,19.74) v2(34.63,26.63) v2(34.61,24.81) v2(34.79,37.42) v2(34.85,35.86) v2(34.89,31.84) v2(34.86,30.51) v2(34.88,29.28) v2(35.23,34.43) v2(35.5,38.76) v2(35.62,21.27) v2(35.98,25.86) v2(36.25,23.87) v2(36.55,17.62) v2(36.81,22.33) v2(36.83,20.73) v2(37.9,39.96) v2(38.48,17.57) v2(38.56,43.65) v2(39.93,17.58) v2(40.18,41.84) v2(41.25,17.36) v2(41.34,20) v2(41.36,40.19) v2(42.43,16.63) v2(43.15,43.69) v2(43.96,41.9) v2(44.21,40.05) v2(46.11,18.2) v2(46.17,19.89) v2(47.27,41.93) v2(48,39.85) v2(51.2,43.69) v2(51.38,39.59) v2(51.57,34.2) v2(51.57,33.01) v2(51.57,31.81) v2(51.57,30.62) v2(51.57,29.42) v2(51.57,28.23) v2(51.57,27.04) v2(51.68,37.89) v2(52.31,36.69) v2(52.28,35.33) v2(53.3,30.62) v2(53.25,26.99) v2(53.72,32.03) v2(54.12,29.65) v2(54.2,28.18) v2(54.39,35.77) v2(55.22,22.08) v2(55.27,41.91) v2(55.61,26.94) v2(55.75,28.95) v2(55.97,37.91) v2(55.95,30.97) v2(56.8,28.13) v2(56.85,32.9) v2(57.28,36.48) v2(57.88,43.46) v2(58.23,33.87) v2(58.38,40.35) v2(58.53,32.04) v2(59.59,36.33) v2(60.03,28.83) v2(60.34,33.01) v2(61.8,35.07) v2(62.54,28.88) v2(62.6,32.33) v2(63.42,36.98) v2(64.18,28.87) v2(64.26,34.77) v2(65.75,36.65) v2(66.2,28.91) v2(66.71,34.74) v2(67.04,32.08) v2(67.02,29.77)
VBAT+: length 18.4
  Inner2 w0.12: v2(12.36,19.23) 12.14,19.45 8.48,19.45 7.69,20.24 7.69,25.05 7.54,25.32 7.27,25.67 5.44,27.89 4.99,28.61
  Inner2 w0.15: 3.91,28.63 3.93,28.62 5,28.62
  Bottom Layer w0.15: 7.71,22.68 7.9,22.68 8.06,22.53 ; 8.06,22.51 8.06,20.48 7.71,20.14
  vias: v2(0.78,37.71) v2(0.83,33.65) v2(0.84,27.08) v2(0.9,35.67) v2(0.88,29.99) v2(0.86,25.32) v2(0.88,23.76) v2(0.9,22.18) v2(1.48,31.9) v2(1.53,28.63) v2(2.08,37.71) v2(2.12,33.65) v2(2.13,27.08) v2(2.17,29.99) v2(2.16,25.32) v2(2.18,23.76) v2(2.19,22.18) v2(3.09,31.89) v2(3.37,37.71) v2(3.42,33.65) v2(3.43,27.08) v2(3.46,29.99) v2(3.45,25.32) v2(3.47,23.76) v2(3.48,22.18) v2(4.66,37.71) v2(4.68,35.57) v2(4.71,33.65) v2(4.72,27.08) v2(4.74,25.32) v2(4.76,31.92) v2(4.76,29.99) v2(4.77,23.76) v2(4.78,22.18) v2(6.12,23.71) v2(6.06,22.13) v2(6.17,25.27) v2(7.18,24.5) v2(7.15,23.09) v2(7.17,21.74)
ADC1_I_BAT: length 24.1
  Inner2 w0.15: 32.15,6.99 31.39,7.74 22.87,7.74 21.3,9.31 18.17,9.31 v1(16.57,10.91)
  Bottom Layer w0.254: 13.19,8.95 13.13,9 11.41,9 ; U1.10 32.25,6.91 v1(32.17,6.99) ; 15.92,10.8 15.88,10.8 14.06,8.98 13.44,8.98
ADC1_I_IN: length 19.2
  Inner2 w0.15: v1(18.59,10.89) 18.59,10.27 19.12,9.74 21.57,9.74 23.2,8.11 31.92,8.11 32.75,7.29 v1(32.75,6.39)
  Bottom Layer w0.254: 18.63,10.33 18.62,10.33 18.62,11.42 ; U1.9 v1(32.75,6.39)
ADC1_I_OUT: length 24.7
  Inner2 w0.15: v1(31.05,8.64) 32.06,8.64 33.49,10.06 49.8,10.06 51.02,11.29 v1(51.02,11.59)
  Bottom Layer w0.254: 50.16,11.64 52.12,11.64 52.15,11.67 ; v1(31.05,8.64) 31,8.69 U1.17
ADC1_VIN: length 30.8
  Inner2 w0.15: v1(33.27,7.01) 33.27,9.49 33.5,9.71 50.05,9.71 54.32,13.98 v1(56.7,13.98)
  Bottom Layer w0.254: 57.34,14.05 57.28,13.98 v1(56.7,13.98) 56.14,13.98 ; v1(33.27,7.01) 33.25,6.99 U1.8
ADC1_VOUT: length 23.3
  Inner2 w0.15: v1(13.97,11.86) 14.17,11.86 15.57,10.46 16.62,10.46 18.12,8.96 21.17,8.96 22.75,7.39 30.77,7.39 v1(31.75,6.41)
  Bottom Layer w0.254: U1.11 v1(31.75,6.41) ; 14.74,12.49 14.72,12.47 13.98,12.47 ; 13.28,12.47 13.98,12.47 ; 13.98,12.47 13.97,12.46 v1(13.97,11.86)
BOOT0: length 1.5
  Bottom Layer w0.254: 39.72,8.13 39.66,8.19 38.28,8.19
CAN_H: length 5.5
  Top Layer w0.254: v1(54.52,5.47) 55.77,5.47 56.12,5.12 ; 56.12,5.12 56.12,7.04 56.07,7.1 ; 56.12,5.12 CAN1.2
  Bottom Layer w0.254: v1(54.52,5.47) 54.51,5.47 U5.7
CAN_L: length 6.7
  Top Layer w0.254: CAN1.1 v1(57.37,6.16) 57.37,6.9 R15.2
  Bottom Layer w0.254: U5.6 57.33,6.12 v1(57.37,6.16)
CAN_RX: length 1.5
  Bottom Layer w0.254: 48.38,7 48.6,6.77 U5.4
CAN_TX: length 1.6
  Bottom Layer w0.254: R82.2 48.27,4.82 U5.1
G1_H: length 6.8
  Bottom Layer w0.5: 24.42,22.23 23.37,22.23 22.87,22.73 22.87,26.91 23.46,27.51
G1_L: length 10.1
  Bottom Layer w0.5: 29.18,27.47 28.32,26.61 28.32,24.58 27.82,24.08 27.82,20.21 28.32,19.71 29.83,19.71 29.9,19.64
G2_H: length 8.6
  Bottom Layer w0.5: 42.92,26.03 44.08,26.03 46.01,24.1 46.01,21.48 45.48,20.96 44.17,20.96
G2_L: length 5.5
  Bottom Layer w0.5: 39.02,27.47 39.02,27.34 37.46,25.78 37.46,23.98 37.93,23.51 38.6,23.51
I_BAT: length 2.2
  Bottom Layer w0.254: 7.29,10.82 7.29,9.87 8.18,8.98
LED_STATE: length 5.8
  Top Layer w0.254: v1(36,4.04) 37.15,2.89 R3.1
  Bottom Layer w0.254: U1.2 36.25,4.28 v1(36,4.04)
NRST: length 2.3
  Top Layer w0.254: C13.2 34.19,6.58 v1(34.27,6.5)
  Bottom Layer w0.254: v1(34.27,6.5) 34.21,6.5 33.75,6.04 33.75,5.22 33.77,5.19
OSC_IN: length 1.9
  Bottom Layer w0.254: 34.75,5.19 34.75,3.24
PWM_A_H: length 2
  Bottom Layer w0.2: 34.03,15.47 33.74,15.18 33.74,13.54
PWM_A_L: length 2.2
  Bottom Layer w0.2: 34.25,13.68 34.25,14.74 35.03,15.52
PWM_B_H: length 2.1
  Bottom Layer w0.2: 31.76,13.71 31.76,13.85 31.76,13.86 31.76,14.61 31,15.37 31,15.45 30.98,15.46
PWM_B_L: length 1.9
  Bottom Layer w0.2: 32.23,13.67 32.23,15.18 31.94,15.47
SW1: length 44.6
  Inner1 w0.5: 27.49,29.19 31.07,29.19 31.13,29.24 ; 26.22,30.49 31.17,30.49 31.2,30.52 ; 26.2,31.79 31.15,31.79 31.18,31.76 ; 26.21,33.08 31.22,33.08 31.23,33.08
  Inner2 w0.5: 26.22,33.09 31.22,33.09 ; 31.18,30.56 31.14,30.51 26.23,30.51 ; 26.2,31.78 31.2,31.78 ; 27.47,29.2 31.1,29.2 31.12,29.22
  Bottom Layer w0.5: 27.78,29.17 27.8,29.14 27.8,27.56 ; 24.4,23.62 24.4,24.85 24.75,25.2 ; 27.77,27.51 26.84,26.58 25.54,26.58 24.75,25.78 24.75,25.6
  vias: v2(26.22,33.07) v2(26.21,31.78) v2(26.24,30.51) v2(26.65,38.2) v2(26.65,37.13) v2(26.65,36.04) v2(26.68,34.96) v2(27.53,30.52) v2(27.49,29.21) v2(27.57,33.05) v2(27.55,31.77) v2(27.78,38.2) v2(27.78,37.13) v2(27.78,36.04) v2(27.81,34.96) v2(28.71,29.21) v2(28.79,33.05) v2(28.77,31.77) v2(28.75,30.52) v2(28.9,38.2) v2(28.9,37.13) v2(28.9,36.04) v2(28.93,34.96) v2(29.93,29.21) v2(30.03,38.2) v2(30.03,37.13) v2(30.03,36.04) v2(30.01,33.05) v2(29.98,31.77) v2(29.96,30.52) v2(30.06,34.96) v2(31.14,29.21) v2(31.16,38.2) v2(31.16,37.13) v2(31.16,36.04) v2(31.19,34.96) v2(31.22,33.05) v2(31.2,31.77) v2(31.18,30.52)
SW2: length 50.1
  Inner1 w0.5: 40.41,30.55 41.79,30.55 41.8,30.56 ; 36.75,29.3 41.78,29.3 41.78,29.29 ; 40.49,30.56 36.78,30.56 36.75,30.53 ; 36.78,33.11 40.44,33.11 ; 41.79,31.84 41.76,31.81 36.77,31.81
  Inner2 w0.5: 36.79,33.09 40.45,33.09 40.47,33.11 ; 36.77,30.54 41.81,30.54 41.81,30.54 ; 41.81,29.28 41.8,29.29 36.74,29.29 ; 36.76,31.8 41.78,31.8 41.8,31.83
  Bottom Layer w0.5: 39.28,25.04 39.54,25.04 40.54,24.04 40.54,22.39 43.27,19.66 44.17,19.66 ; 39.23,25.56 40.18,26.51 40.18,27.61 ; 40.19,27.52 40.19,29.08 v2(40.4,29.29)
  vias: v2(36.7,38.33) v2(36.71,37.21) v2(36.73,36.07) v2(36.73,35) v2(36.81,33.1) v2(36.79,31.83) v2(36.78,30.55) v2(36.75,29.29) v2(37.87,38.33) v2(37.88,37.21) v2(37.91,36.07) v2(37.91,35) v2(38.02,33.1) v2(38.01,31.83) v2(37.99,30.55) v2(37.97,29.29) v2(39.05,38.33) v2(39.06,37.21) v2(39.09,36.07) v2(39.08,35) v2(39.24,33.1) v2(39.22,31.83) v2(39.21,30.55) v2(39.18,29.29) v2(40.23,38.33) v2(40.24,37.21) v2(40.27,36.07) v2(40.26,35) v2(40.44,31.83) v2(40.43,30.55) v2(40.46,33.1) v2(41.41,38.33) v2(41.42,37.21) v2(41.45,36.07) v2(41.44,35) v2(41.81,31.82) v2(41.83,30.55) v2(41.81,29.26)
SWCLK: length 7.9
  Top Layer w0.254: v1(42.22,7.86) 42.22,9.5 40.95,10.78 v1(40.95,10.99)
  Bottom Layer w0.254: U1.38 39.32,11.69 40.02,10.99 v1(40.95,10.99) ; v1(42.22,7.86) R1.2
SWDIO: length 7.6
  Top Layer w0.254: v1(41.07,8.56) 41.07,9.89 40.31,10.65 v1(40.31,11.58)
  Bottom Layer w0.254: v1(41.07,8.56) 41.07,8.56 41.07,6.65 ; v1(40.31,11.58) 39.7,12.19 U1.37
VBOOST: length 32.1
  Inner1 w0.5: 43.86,29.25 47.53,29.25 47.55,29.27 ; 43.94,33.12 47.62,33.12 47.63,33.12 ; 43.93,31.82 47.58,31.82 ; 47.59,30.57 47.58,30.57 43.9,30.57
  Inner2 w0.5: 43.92,31.79 47.49,31.79 47.54,31.84 ; 43.82,29.25 47.49,29.25 47.5,29.27 ; 47.56,30.58 47.54,30.57 43.91,30.57 ; 47.59,33.09 47.56,33.12 43.92,33.12
  Bottom Layer w0.15: 50.52,22.48 50.82,22.79 50.82,24.55 50.55,24.82 50.4,24.82
  vias: v2(43.94,33.1) v2(43.92,31.81) v2(43.9,30.56) v2(43.86,29.26) v2(44.09,38.35) v2(45.14,31.81) v2(45.12,30.56) v2(45.08,29.26) v2(45.16,33.1) v2(45.31,38.35) v2(46.34,30.56) v2(46.3,29.26) v2(46.38,33.1) v2(46.36,31.81) v2(46.35,25.11) v2(46.52,38.35) v2(47.07,23.75) v2(47.2,26.1) v2(47.52,29.26) v2(47.6,33.1) v2(47.58,31.81) v2(47.56,30.56) v2(47.74,38.35) v2(47.94,24.68) v2(48.71,26.14) v2(48.78,23.8) v2(49.84,29.23) v2(49.91,31.82) v2(49.88,25.98) v2(49.91,24.75) v2(49.92,23.65)
VBUCK: length 32.5
  Inner1 w0.5: 24.37,29.28 24.31,29.22 20.71,29.22 ; 24.47,31.81 24.45,31.78 v2(23.23,31.78) v2(22.01,31.78) 20.75,31.78 ; 20.72,30.52 24.34,30.52 24.4,30.58 ; 24.43,33.08 24.39,33.04 20.81,33.04
  Inner2 w0.5: 24.47,33.06 24.45,33.08 20.8,33.08 ; 24.45,30.51 24.45,30.51 20.75,30.51 ; 24.39,29.24 24.36,29.21 20.71,29.21 ; 24.45,31.77 24.43,31.79 20.79,31.79
  Bottom Layer w0.15: 18.71,24.57 18.5,24.57 18.26,24.34 18.26,22.33 18.44,22.16 ; 18.58,21.98 18.45,22.11 18.45,22.17
  vias: v2(17.8,29.39) v2(17.85,32.07) v2(19.23,23.45) v2(19.26,25.69) v2(19.26,24.67) v2(20.12,38.15) v2(20.44,23.24) v2(20.53,24.67) v2(20.73,29.23) v2(20.81,33.07) v2(20.79,31.78) v2(20.77,30.53) v2(20.97,25.72) v2(21.34,38.15) v2(21.46,24.07) v2(22.03,33.07) v2(21.99,30.53) v2(21.95,29.23) v2(21.97,25.2) v2(22.08,23.24) v2(22.56,38.15) v2(23.25,33.07) v2(23.21,30.53) v2(23.17,29.23) v2(23.78,38.15) v2(24.44,31.78) v2(24.42,30.53) v2(24.38,29.23) v2(24.46,33.07)
VCAP+: length 22.4
  Inner2 w0.12: 66.18,27.84 66.75,27.84 67.08,27.51 67.08,23.64 66.39,22.95 54.15,22.95 53.84,22.64
  Bottom Layer w0.15: 51.3,22.41 51.23,22.49 51.23,22.64 51.09,22.77 51.09,24.58 51.28,24.77 51.38,24.77 51.41,24.74
  Bottom Layer w0.254: 53.75,22.59 53.75,21.68 53.91,21.52
  vias: v2(52.04,25.94) v2(52.07,24.72) v2(52.08,23.61) v2(53.78,22.63) v2(54.08,25.73) v2(54.08,23.72) v2(55.59,25.87) v2(55.56,24.39) v2(56.78,26.52) v2(56.99,23.75) v2(59.5,27.33) v2(59.56,23.78) v2(60.73,25.15) v2(60.95,27.4) v2(62.41,27.37) v2(62.37,23.83) v2(62.88,25.21) v2(63.67,27.5) v2(64.55,23.78) v2(65.98,23.94) v2(66.32,27.55)
VCHASSIS+: length 6.3
  Bottom Layer w0.15: 17.35,24.56 17.37,24.58 17.82,24.58 18.01,24.39 18.01,22.38 17.62,21.99 ; 8.62,20.11 8.62,20.15 8.32,20.45 8.32,22.52 8.47,22.67 8.69,22.67
  vias: v2(9.23,23.1) v2(9.22,21.72) v2(9.25,24.5) v2(10.58,23.57) v2(10.58,22.32) v2(10.61,20.8) v2(10.67,24.79) v2(11.92,24.79) v2(11.86,20.8) v2(13.11,20.8) v2(13.44,24.79) v2(14.37,23.01) v2(14.36,20.8) v2(14.88,24.34) v2(14.86,21.77) v2(15.62,23.01) v2(15.62,20.8) v2(15.66,25.73) v2(16.13,24.34) v2(16.11,21.77) v2(17.18,25.69) v2(17.15,24.67) v2(17.15,23.49)
$1N38: length 1.4
  Bottom Layer w0.254: 42.28,4.42 42.24,4.46 ; 42.24,4.46 42.24,5.7 ; 42.24,4.46 42.24,4.43 ; 42.27,4.39 42.23,4.43
$1N41: length 1.4
  Bottom Layer w0.254: 41.08,4.44 41.08,5.7 41.15,5.77
$1N998: length 1.8
  Top Layer w0.254: R3.2 43.12,2.89 LED2.2
$1N999: length 1.8
  Top Layer w0.254: LED1.2 43.36,1.51 R4.2
$1N16846: length 20.4
  Top Layer w0.2: v1(43.95,10.96) 43.95,8.21 v1(43.97,8.19)
  Bottom Layer w0.2: v1(43.95,10.96) 43.95,13.79 42.27,15.46 35.92,15.46 35.25,14.79 U1.33
  Bottom Layer w0.254: R83.1 45.16,7 v1(43.97,8.19)
$1N16848: length 20.7
  Top Layer w0.2: v1(43.2,8.66) 43.2,10.91 v1(43.25,10.96)
  Bottom Layer w0.2: U1.34 35.75,14.86 36.05,15.16 42.02,15.16 43.25,13.94 v1(43.25,10.96)
  Bottom Layer w0.254: v1(43.2,8.66) 43.2,8.09 46.45,4.84 R82.1
$2N10: length 3
  Top Layer w0.254: 5.34,13.5 6.63,13.5 6.88,13.75 ; 6.9,15.01 6.9,13.68
$2N12: length 1.5
  Top Layer w0.5: 5.28,11.51 5.28,10.35 5.02,10.09
$2N68: length 2.8
  Top Layer w0.254: 3.04,13.44 1.6,13.44 ; 1.4,14.49 1.47,14.42 1.47,13.19
$2N18642: length 3.4
  Top Layer w0.256: 9.17,2.94 9.86,2.94 10.19,2.61 10.19,1.8
  Bottom Layer w0.256: 7.68,3.05 9.02,3.05 9.09,2.99
  vias: v2(9.17,2.96)
$2N18644: length 1.7
  Top Layer w0.5: 6.8,2.74 7.79,1.75 8.1,1.75
$2N18656: length 2.3
  Top Layer w0.254: 10.21,4.07 10.21,4.78 10.5,5.07
  Bottom Layer w0.254: 10.53,5.09 10.48,5.14 10.48,6.24
  vias: v2(10.52,5.1)
$2N36769: length 1.9
  Bottom Layer w0.5: 18.08,2.33 19.18,2.33 19.74,2.89
$2N38911: length 2.8
  Bottom Layer w0.256: 16.18,0.92 17.39,0.92 17.4,0.91 ; 16.18,0.92 16.08,0.92 ; 16.18,0.92 16.18,2.27 16.12,2.34 ; 16.18,0.92 16.18,0.9
$3N48: length 6.8
  Bottom Layer w0.2: 33.96,17.39 33.94,17.36 33.94,16.43 ; 33.99,17.45 33.99,18.06 35.59,19.66 38.49,19.66
$3N49: length 10.4
  Bottom Layer w0.2: 35.04,17.44 35.04,17.43 35.04,16.38 ; 38.46,20.93 38.47,20.94 39.78,20.94 40.1,20.62 40.1,19.56 39.6,19.07 35.82,19.07 34.99,18.24 34.99,17.36
$3N12544: length 4.2
  Bottom Layer w0.5: 25.21,27.62 25.38,27.62 26.17,28.42 ; 26.25,27.59 26.26,27.6 ; 26.25,27.59 26.25,29.21 26.27,29.23 ; 26.25,27.59 26.25,27.54 ; 26.25,27.59 26.21,27.55 25.03,27.55
$3N12574: length 3.6
  Bottom Layer w0.5: 33.19,29.29 33.19,28.92 31.86,27.59 ; 30.56,27.56 31.93,27.56
$3N12747: length 7.5
  Bottom Layer w0.5: 41.84,33.12 42.26,33.12 42.83,32.56 42.83,27.6 ; 41.66,27.56 41.68,27.58 43,27.58
$3N12777: length 7.3
  Bottom Layer w0.5: 36.17,27.5 35.84,27.83 35.84,32.5 35.14,33.2 ; 37.36,27.48 36.15,27.48
$3N13252: length 10.6
  Bottom Layer w0.2: 30.94,16.35 30.94,17.43 ; 29.49,23.5 28.99,23.5 28.62,23.13 28.62,21.91 28.91,21.62 30.92,21.62 31.69,20.85 31.69,18.08 30.99,17.37
$3N13253: length 7.1
  Bottom Layer w0.2: 30.38,22.24 30.44,22.17 31,22.17 32.08,21.09 32.08,18.65 32.27,18.45 ; 31.96,16.36 32.05,16.45 32.05,18.3 32.2,18.46
$3N13344: length 5.3
  Bottom Layer w0.5: 41.41,25.37 41.41,23.39 42.62,22.18 44.21,22.18
$3N13359: length 6.1
  Bottom Layer w0.5: 24.32,20.97 25.88,20.97 26.65,21.74 26.65,25.16
$4N408: length 2.9
  Bottom Layer w0.254: 55.15,20.02 53.95,20.02 53.91,20.06 ; 54.44,18.48 54.44,19.82 54.25,20
$4N414: length 3
  Bottom Layer w0.254: 57.38,16.21 57.33,16.26 55.81,16.26 ; 57.38,16.21 57.38,15.37 57.4,15.36 ; 57.38,16.21 57.38,16.78 ; 57.38,16.21 57.4,16.19
$4N415: length 3.4
  Bottom Layer w0.254: 55.78,18.57 55.78,18.9 56.22,19.35 56.22,19.71 56.5,19.99 ; 57.45,18.35 57.35,18.45 55.8,18.45
$4N793: length 3
  Bottom Layer w0.254: 11.9,16.08 11.9,16.95 12.27,17.32 ; 12.27,17.32 13.72,17.32 13.77,17.27 ; 12.27,17.32 12.28,17.33 ; 12.27,17.32 12.23,17.32
$4N795: length 3.3
  Bottom Layer w0.254: 11.88,12.65 11.9,12.65 13.13,13.88 ; 13.13,13.9 14.21,13.9 14.57,14.26
$4N797: length 3.2
  Bottom Layer w0.254: 14.62,15.94 15.04,16.37 15.04,17.29 ; 14.62,15.94 14.61,15.94 ; 14.62,15.94 14.52,16.04 13.12,16.04 ; 14.62,15.94 14.69,15.87
$4N1095: length 2.5
  Bottom Layer w0.254: 13.37,10.91 13.23,11.04 12.34,11.04 ; 11.34,10.1 11.34,10.33 12.18,11.18
$4N1098: length 2.4
  Bottom Layer w0.254: 10.38,10.1 10.4,10.08 10.4,8.96 ; 9.12,8.98 10.31,8.98 10.38,9.05
$4N1460: length 2.6
  Bottom Layer w0.15: 50.44,21.53 50.44,21.46 50.57,21.33 50.57,19.03
$4N1461: length 2.6
  Bottom Layer w0.15: 51.41,21.52 51.21,21.32 51.21,18.96
$4N1465: length 1.9
  Bottom Layer w0.254: 49.22,11.65 49.22,11.86 49.88,12.53 ; 49.88,12.53 49.9,12.51 ; 49.88,12.53 49.94,12.59 ; 49.88,12.53 49.87,12.54 49.87,13.14
$4N1760: length 2.7
  Bottom Layer w0.15: 7.66,18.15 7.66,19.22 7.65,19.23 ; 7.66,18.15 7.66,18.09 ; 7.66,18.15 7.84,17.97 7.84,16.69
$4N1761: length 2.6
  Bottom Layer w0.15: 8.63,19.16 8.71,19.08 8.71,18.12 ; 8.5,16.7 8.5,18.07 8.57,18.15 8.6,18.15
$4N2130: length 2.4
  Bottom Layer w0.15: 17.56,20.04 17.61,20.08 17.61,21.12 17.6,21.13 ; 17.69,20.06 17.75,20 17.75,18.82
$4N2131: length 2.5
  Bottom Layer w0.15: 18.58,21.09 18.58,21.09 18.58,20.13 18.65,20.06 ; 18.45,18.7 18.45,20.04 18.52,20.1
$4N2136: length 1.7
  Bottom Layer w0.254: 17.64,11.43 17.09,11.98 17.09,12.87

## Copper pours and planes (outline as drawn; the poured copper is in the pictures)
5V on Top Layer: 1.85,2.59 5.79,2.59 5.94,2.43 5.94,1.22 5.73,1.02 1.95,1.02 1.81,1.15 1.81,2.55
5V on Bottom Layer: 13.96,2.32 11.62,2.32 12.04,2.74 12.04,3.86 14.66,3.86 15.69,4.46 15.69,5.73 15.81,5.85 17.49,5.85 17.51,5.83 17.51,4.6 15.07,3.14
10V on Top Layer: 4.71,9.1 4.55,8.94 4.55,6.56 4.45,6.46 5.79,5.11 8.31,5.11 8.69,5.5 8.69,6.39 7.81,7.27 7.81,10.25 6.73,11.34 6.54,11.34 6.54,10.34 5.3,9.1
10V on Bottom Layer: 42.53,24.65 42.53,23.23 42.79,22.97 42.79,22.96 45.42,22.96 45.51,23.05 45.51,23.94 44.76,24.68 42.56,24.68
10V on Inner1: 4.8,7.01 4.8,5.4 4.82,5.39 7.47,5.39 7.57,5.49 7.57,6.89 7.42,7.04 4.83,7.04
10V on Inner2: 23.5,18.74 25.22,18.74 25.25,18.71 25.25,17.33 25.17,17.25 23.74,17.25 23.5,17.49
10V on Inner2: 43.4,18.66 43.4,17.23 43.47,17.16 44.99,17.16 45.01,17.18 45.01,18.64 43.44,18.64 43.43,18.66
10V on Inner2: 42.78,24.38 42.8,24.25 42.8,23.98 43.53,23.25 45.24,23.25 45.24,23.72 44.49,24.47 42.78,24.47 42.78,24.42
24V on Top Layer: 3.26,21.55 3.26,19.74 2.36,18.84 2.36,15.38 3.77,13.97 3.77,13.22 3.55,13 2.45,13 2.31,12.87 2.31,12.22 2.46,12.08 3.79,12.08 4.46,12.95 4.46,15.24 4.05,15.65 4.05,18.77 4.84,19.55 5.23,19.55 5.23,19.58
A3V3 on Bottom Layer: 23.37,10.76 23.37,9.78 23.15,9.56 23.15,6.42 23.22,6.35 23.98,6.35 24.03,6.41 24.03,8.17 24.74,8.84 24.73,10.4 24.27,10.76
AGND on Bottom Layer: 24.15,6.51 23.75,6.11 23.75,5.74 24.35,5.14 27.82,5.14 28.55,5.86 28.55,9.04 28.95,9.44 32.47,9.44 32.5,9.41 32.5,9.84 32.3,10.04 26.1,10.04 24.15,8.09
AGND on Inner1: 6.92,17.37 6.92,11.24 9.57,8.59 12.5,8.59 13.78,7.3 22.7,7.3 23.1,6.91 23.1,6.01 24.02,5.09 33.45,5.11 33.87,6.26 33.85,8.16 34.77,8.79 49.85,8.81 51.62,10.54 53.45,10.54 56.15,13.24 57.22,13.24 57.7,13.71 57.95,13.71 57.95,19.69 57.32,20.31 49.7,20.31 49.22,19.84 49.22,14.79 48.45,14.01 38.32,14.11 37.22,12.91 23.5,12.94 20.8,15.64 20.8,18.29 19.79,19.06 16.12,19.06 14.67,17.46 9.63,17.44
AGND on Inner2: 57.95,13.81 57.4,13.26 56.17,13.26 53.4,10.49 51.65,10.49 50,8.84 34.9,8.84 33.82,7.71 33.85,6.39 32.65,5.19 23.95,5.19 21.75,7.39 13.65,7.39 12.45,8.59 9.7,8.59 7.02,11.26 7.02,17.42 7.18,17.58 14.57,17.58 16.67,19.69 19.22,19.69 20.67,18.24 20.67,15.74 23.47,12.94 37.12,12.94 38.27,14.09 48.52,14.09 49.22,14.79 49.22,19.84 49.7,20.31 57.22,20.31 57.8,19.74 57.95,19.74
D3V3 on Bottom Layer: 22.38,4.58 22.38,1.61 22.69,1.29 23.49,1.29 23.78,1.59 23.78,2.39 24.1,2.71 25.28,2.71 25.28,3.62 25.15,3.76 23.77,3.76 23.46,4.07 23.46,4.52 23.4,4.58
GND on Top Layer: -4,22.89 71.07,22.89 71.07,-6.09 -4,-6.09
GND on Bottom Layer: -4.64,23.12 70.43,23.12 70.43,-5.85 -4.64,-5.85
GND on Inner1: -2.44,22.47 72.63,22.47 72.63,-6.5 -2.44,-6.5
GND on Inner2: -2.17,22.65 72.91,22.65 72.91,-6.33 -2.17,-6.33
PGND on Top Layer: -0.31,38.43 -0.31,25.31 -0.31,25.3 14.8,25.3 15.58,26.08 22.57,26.08 22.75,25.9 22.75,17.37 23.42,16.7 27.5,16.7 27.92,17.12 40.81,17.12 41.65,16.28 46.64,16.28 47.29,16.94 47.29,26.01 47.9,26.61 50.59,26.61 50.73,26.47 56.07,26.47 57.46,27.86 59.13,27.86 59.72,28.45 68.48,28.45 68.53,28.5 68.53,37.99 68.45,38.07 61.25,38.07 60.51,38.81 60.51,45.55 60.64,45.68 8.51,45.68 7.4,44.57 7.4,39.59 6.18,38.37 0.04,38.37 -0.01,38.42 -0.3,38.42
PGND on Bottom Layer: -0.53,38.35 -0.53,25.23 -0.54,25.23 14.58,25.23 15.35,26 22.35,26 22.53,25.83 22.53,17.3 23.2,16.62 27.28,16.62 27.7,17.04 40.59,17.04 41.43,16.21 46.42,16.21 47.07,16.86 47.07,25.93 47.68,26.54 50.36,26.54 50.51,26.39 55.85,26.39 57.24,27.78 58.9,27.78 59.5,28.37 68.26,28.37 68.31,28.42 68.31,37.91 68.22,38 61.02,38 60.28,38.73 60.28,45.48 60.41,45.61 8.29,45.61 7.18,44.49 7.18,39.51 5.96,38.29 -0.18,38.29 -0.24,38.35 -0.53,38.35
PGND on Inner1: -0.41,38.35 -0.41,25.23 -0.42,25.22 14.7,25.22 15.47,26 22.47,26 22.65,25.82 22.65,17.29 23.32,16.62 27.4,16.62 27.82,17.04 40.71,17.04 41.55,16.2 46.54,16.2 47.19,16.85 47.19,25.93 47.8,26.53 50.48,26.53 50.63,26.38 55.97,26.38 57.36,27.78 59.02,27.78 59.62,28.37 68.38,28.37 68.43,28.42 68.43,37.91 68.34,37.99 61.14,37.99 60.41,38.73 60.41,45.47 60.53,45.6 8.41,45.6 7.3,44.49 7.3,39.5 6.08,38.29 -0.06,38.29 -0.12,38.34 -0.41,38.34
PGND on Inner2: 6.06,38.46 5.64,38.28 5.63,38.09 5.69,29.2 5.7,28.29 8.26,25.35 14.68,25.4 15.45,26.17 22.45,26.17 22.63,25.99 22.63,17.47 23.3,16.79 27.38,16.79 27.8,17.21 40.69,17.21 41.53,16.38 46.52,16.38 47.17,17.03 47.17,26.1 47.78,26.71 50.46,26.71 50.61,26.56 55.95,26.56 57.34,27.95 59.01,27.95 59.6,28.54 68.36,28.54 68.41,28.59 68.41,38.08 68.32,38.17 61.12,38.17 60.39,38.9 60.39,45.65 60.52,45.78 8.39,45.78 7.28,44.66 7.28,39.68
VBAT+ on Top Layer: 4.33,38.26 5.04,37.97 5.33,37.27 5.41,28.4 5.45,28.13 5.56,27.88 7.75,25.24 7.84,24.58 7.86,23.92 7.86,21.02 7.79,20.95 -0.18,20.95 -0.32,21.09 -0.32,37.97 -0.03,38.26
VBAT+ on Bottom Layer: 4.3,38.3 5,38.01 5.3,37.31 5.38,28.44 5.42,28.17 5.53,27.92 7.71,25.28 7.81,24.63 7.82,23.97 7.82,21.06 7.75,20.99 -0.22,20.99 -0.36,21.13 -0.36,38.01 -0.07,38.3
VBAT+ on Inner1: 4.31,38.27 5.02,37.98 5.31,37.27 5.39,28.41 5.43,28.14 5.54,27.89 7.72,25.25 7.82,24.59 7.84,23.93 7.84,21.02 7.77,20.95 -0.2,20.95 -0.35,21.1 -0.35,37.97 -0.05,38.27
VBAT+ on Inner2: 3.94,38.28 4.65,37.99 4.94,37.29 5.02,28.42 5.06,28.15 5.17,27.9 7.36,25.26 7.45,24.61 7.47,23.95 7.47,21.04 7.4,20.97 -0.57,20.97 -0.71,21.11 -0.71,37.99 -0.42,38.28
SW1 on Top Layer: 25.79,29.99 26.47,29.99 26.66,29.95 26.83,29.85 26.84,29.83 26.95,29.67 26.99,29.48 26.99,28.83 27.07,28.75 31.79,28.75 31.98,28.94 31.98,38.78 31.87,38.9 25.42,38.9 25.13,38.6 25.13,35.18 25.17,34.99 25.27,34.82 25.35,34.74 25.46,34.58 25.5,34.39 25.5,30.27 25.51,30.27
SW1 on Bottom Layer: 25.78,29.98 26.47,29.98 26.66,29.94 26.82,29.83 26.84,29.81 26.94,29.65 26.98,29.46 26.98,28.81 27.06,28.74 31.79,28.74 31.97,28.92 31.97,38.76 31.86,38.88 25.41,38.88 25.12,38.59 25.12,35.16 25.16,34.97 25.27,34.81 25.35,34.73 25.46,34.56 25.49,34.37 25.49,30.25 25.5,30.25
SW1 on Inner1: 26.45,38.43 26.49,38.4 26.49,34.81 26.53,34.77 31.46,34.77 31.46,38.33 31.34,38.46 26.48,38.46
SW1 on Inner2: 26.35,38.46 26.35,34.73 26.44,34.65 31.43,34.65 31.53,34.75 31.53,38.3 31.36,38.47 26.36,38.47
SW2 on Top Layer: 36.34,38.75 36.21,38.63 36.21,28.96 36.44,28.74 42.32,28.74 42.43,28.84 42.43,34.36 42.47,34.55 42.58,34.71 42.74,34.87 42.85,35.03 42.88,35.22 42.88,38.68 42.81,38.75
SW2 on Bottom Layer: 36.47,28.75 36.29,28.93 36.29,38.71 36.42,38.84 42.7,38.84 42.89,38.64 42.89,35.2 42.85,35 42.74,34.84 41.5,33.6 41.39,33.43 41.35,33.24 41.35,32.74 41.42,32.68 42.22,32.68 42.41,32.49 42.41,28.85 42.27,28.72 36.5,28.72
SW2 on Inner1: 36.53,38.46 36.57,38.42 36.57,34.83 36.61,34.79 41.54,34.79 41.54,38.36 41.41,38.48 36.56,38.48
SW2 on Inner2: 36.5,38.57 36.5,34.84 36.59,34.75 41.58,34.75 41.68,34.85 41.68,38.4 41.51,38.57 36.51,38.57
VBOOST on Top Layer: 43.46,28.7 43.22,28.94 43.2,28.94 43.2,38.5 43.49,38.78 50.25,38.78 50.45,38.75 50.61,38.64 50.65,38.59 50.76,38.43 50.8,38.24 50.8,37.34 50.84,37.15 50.95,36.99 51.3,36.64 51.4,36.48 51.44,36.29 51.44,34.97 51.4,34.78 51.3,34.62 50.81,34.13 50.7,33.97 50.66,33.78 50.66,26.4 50.56,26.3 50.56,23.3 50.45,23.19 46.71,23.19 46.46,23.44 46.46,24.18 46.48,24.2 44.38,26.3 44.22,26.41 44.03,26.45 43.81,26.45 43.56,26.69 43.56,28.36 43.56,28.36 43.46,28.45
VBOOST on Bottom Layer: 43.46,28.74 43.22,28.98 43.2,28.98 43.2,38.54 43.49,38.82 50.25,38.82 50.44,38.79 50.61,38.68 50.65,38.63 50.76,38.47 50.8,38.28 50.8,37.38 50.84,37.19 50.95,37.03 51.29,36.68 51.4,36.52 51.44,36.33 51.44,35.01 51.4,34.82 51.29,34.66 50.81,34.17 50.7,34.01 50.66,33.82 50.66,26.44 50.56,26.34 50.56,23.34 50.45,23.23 46.71,23.23 46.46,23.48 46.46,24.22 46.48,24.24 44.38,26.34 44.22,26.45 44.02,26.49 43.81,26.49 43.56,26.73 43.56,28.4 43.56,28.4 43.46,28.49
VBOOST on Inner1: 46.88,26.36 46.88,23.26 46.93,23.21 50.51,23.21 50.66,23.36 50.66,26.24 50.53,26.36
VBOOST on Inner2: 46.81,26.53 46.81,23.51 46.97,23.35 50.78,23.35 50.78,23.34 50.78,26.4 50.63,26.55 47.62,26.55 47.59,26.58 46.86,26.58
VBUCK on Top Layer: 18.54,22.75 18.67,22.62 22.51,22.62 22.59,22.7 22.59,26.85 22.63,27.04 22.74,27.21 22.78,27.25 22.89,27.41 22.93,27.6 22.93,27.91 23.08,28.06 25.05,28.06 25.07,28.04 25.07,34.08 25.03,34.27 24.92,34.43 24.82,34.53 24.71,34.69 24.68,34.89 24.68,38.69 24.43,38.94 17.84,38.94 17.64,38.9 17.48,38.79 17.2,38.51 17.1,38.35 17.06,38.16 17.06,37.01 17.02,36.82 16.91,36.66 16.76,36.51 16.65,36.34 16.61,36.15 16.61,34.93 16.84,34.71 16.84,29.02 17.13,28.73 17.13,26.4 17.16,26.37 17.86,26.37 18.05,26.33 18.22,26.22 18.41,26.02 18.52,25.86 18.56,25.67 18.56,22.77
VBUCK on Bottom Layer: 18.54,22.79 18.67,22.66 22.51,22.66 22.6,22.74 22.6,26.89 22.64,27.08 22.75,27.25 22.78,27.29 22.89,27.45 22.93,27.64 22.93,27.95 23.08,28.1 25.05,28.1 25.07,28.08 25.07,34.12 25.03,34.31 24.93,34.47 24.83,34.57 24.72,34.73 24.68,34.93 24.68,38.73 24.43,38.98 17.84,38.98 17.65,38.94 17.49,38.83 17.21,38.55 17.1,38.39 17.06,38.2 17.06,37.05 17.02,36.86 16.92,36.7 16.76,36.54 16.65,36.38 16.62,36.19 16.62,34.97 16.84,34.75 16.84,29.06 17.13,28.76 17.13,26.44 17.17,26.41 17.87,26.41 18.06,26.37 18.22,26.26 18.42,26.06 18.53,25.9 18.56,25.71 18.56,22.8
VBUCK on Inner1: 18.75,25.89 18.75,22.79 18.8,22.74 22.37,22.74 22.52,22.89 22.52,25.76 22.4,25.89
VBUCK on Inner2: 18.52,25.95 18.52,22.93 18.69,22.77 22.49,22.77 22.5,22.76 22.5,25.82 22.35,25.97 19.34,25.97 19.31,26 18.58,26
